# Altium schematic sheet Power.SchDoc: Power Delivery
size A4; Engineer: Jouveer Naidoo; DocumentNumber: 4; Revision: 1; SheetNumber: 4; SheetTotal: 4; SPICEModelCacheIVYGDNUI: <root> / <DocumentId>IVYGDNUI</DocumentId> / <CacheFrame Number="0"> / <Model Name="cap" Kind="MDL"> / <Text>*Default semiconductor capacitor / .MODEL CAP C()</Text> / </Model> / </CacheFrame> / </root>; ProjectIdentifier: Spin Up
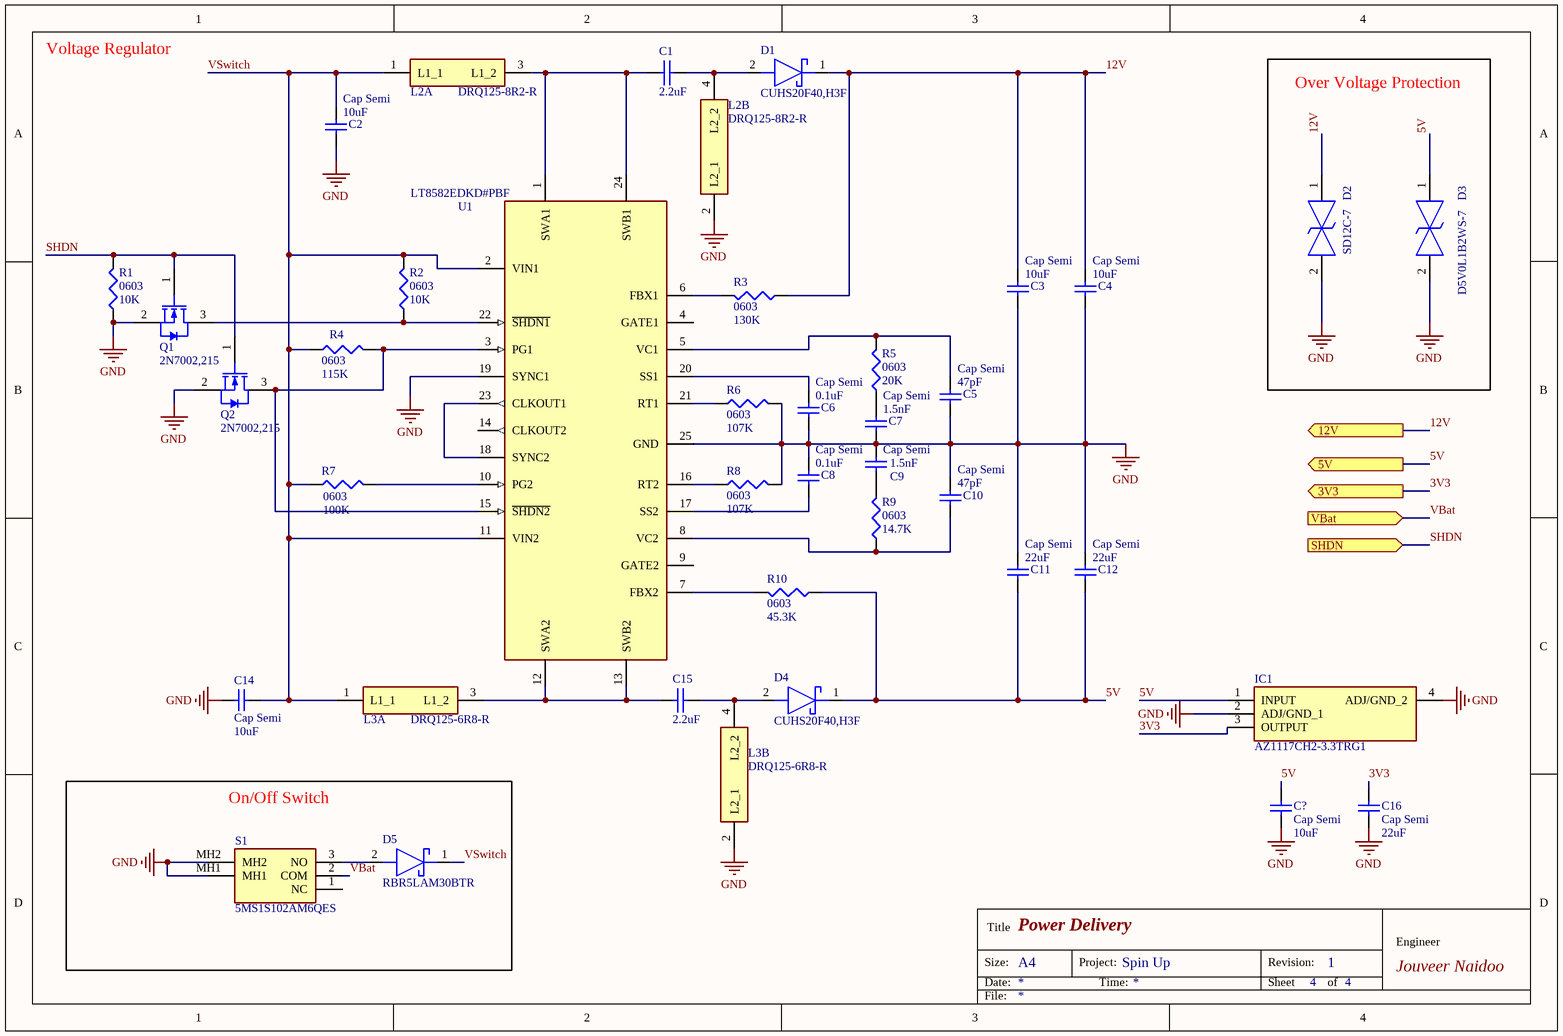
[diagram p0: Power.SchDoc]

## Parts
C1  value 2.2uF  [0805 CAP]  (hidden comment: CerCap_SMT_0805)
C2  Cap Semi  value 10uF  [C1210]
C3  Cap Semi  value 10uF  [C1210]
C4  Cap Semi  value 10uF  [C1210]
C5  Cap Semi  value 47pF  [1608[0603]]
C6  Cap Semi  value 0.1uF  [1608[0603]]
C7  Cap Semi  value 1.5nF  [1608[0603]]
C8  Cap Semi  value 0.1uF  [1608[0603]]
C9  Cap Semi  value 1.5nF  [1608[0603]]
C10  Cap Semi  value 47pF  [1608[0603]]
C11  Cap Semi  value 22uF  [C1210]
C12  Cap Semi  value 22uF  [C1210]
C14  Cap Semi  value 10uF  [C1210]
C15  value 2.2uF  [0805 CAP]  (hidden comment: CerCap_SMT_0805)
C16  Cap Semi  value 22uF  [C1210]
C?  Cap Semi  value 10uF  [C1210]
D1  CUHS20F40,H3F  [CUHS20F40H3F]
D2  SD12C-7  [SD12C7]
D3  D5V0L1B2WS-7  [D5V0L1B2WS7]
D4  CUHS20F40,H3F  [CUHS20F40H3F]
D5  RBR5LAM30BTR  [SODFL4725X105N]
IC1  AZ1117CH2-3.3TRG1  [SOT230P700X180-4N]
L2  DRQ125-8R2-R  [DRQ125-8R2-R-Footprint-1]  (parts A,B of 2)
L3  DRQ125-6R8-R  [DRQ125-6R8-R-Footprint-1]  (parts A,B of 2)
Q1  2N7002,215  [NXP-SOT23-3_V]
Q2  2N7002,215  [NXP-SOT23-3_V]
R1  0603  value 10K  [J1-0603]
R2  0603  value 10K  [J1-0603]
R3  0603  value 130K  [J1-0603]
R4  0603  value 115K  [J1-0603]
R5  0603  value 20K  [J1-0603]
R6  0603  value 107K  [J1-0603]
R7  0603  value 100K  [J1-0603]
R8  0603  value 107K  [J1-0603]
R9  0603  value 14.7K  [J1-0603]
R10  0603  value 45.3K  [J1-0603]
S1  5MS1S102AM6QES  [5MS1S102AM6QES]
U1  LT8582EDKD#PBF  [FP-DKD-24-05-08-1864-MFG]

## Blocks framed on the sheet
Over Voltage Protection: D2 D3
On/Off Switch: D5 S1

## Ports
3V3 (out), 5V (out), 12V (out), SHDN (in), VBat (in)

## Nets
GND: C2.1 C3.1 C4.1 C5.1 C6.1 C7.1 C8.2 C9.2 C10.2 C11.2 C12.2 C14.1 C16.2 C?.1 D2.2 D3.2 IC1.2(ADJ/GND_1) IC1.4(ADJ/GND_2) L2.2(L2_1) L3.2(L2_1) Q1.2(S) Q2.2(S) R1.1 R6.2 R8.2 S1.MH1 S1.MH2 U1.19(SYNC1) U1.25(GND)
3V3: C16.1 IC1.3(OUTPUT) ; port 3V3
5V: C11.1 C12.1 C?.2 D3.1 D4.1(K) IC1.1(INPUT) R10.1 ; port 5V
12V: C3.2 C4.2 D1.1(K) D2.1 R3.1 ; port 12V
SHDN: Q1.1(G) Q2.1(G) R1.2 ; port SHDN
VBat: S1.2(COM) ; port VBat
VSwitch: C2.2 C14.2 D5.1(K) L2.1(L1_1) L3.1(L1_1) R2.2 R4.1 R7.1 U1.2(VIN1) U1.11(VIN2)
NetC1_1: C1.1 L2.3(L1_2) U1.1(SWA1) U1.24(SWB1)
NetC1_2: C1.2 D1.2(A) L2.4(L2_2)
NetC5_2: C5.2 R5.2 U1.5(VC1)
NetC6_2: C6.2 U1.20(SS1)
NetC7_2: C7.2 R5.1
NetC8_1: C8.1 U1.17(SS2)
NetC9_1: C9.1 R9.2
NetC10_1: C10.1 R9.1 U1.8(VC2)
NetC15_1: C15.1 L3.3(L1_2) U1.12(SWA2) U1.13(SWB2)
NetC15_2: C15.2 D4.2(A) L3.4(L2_2)
NetD5_2: D5.2(A) S1.3(NO)
NetQ1_3: Q1.3(D) R2.1 U1.22(~{SHDN1})
NetQ2_3: Q2.3(D) R4.2 U1.3(PG1) U1.15(~{SHDN2})
NetR3_2: R3.2 U1.6(FBX1)
NetR6_1: R6.1 U1.21(RT1)
NetR7_2: R7.2 U1.10(PG2)
NetR8_1: R8.1 U1.16(RT2)
NetR10_2: R10.2 U1.7(FBX2)
NetU1_18: U1.18(SYNC2) U1.23(CLKOUT1)

Not connected (* = marked no-connect by the designer): S1 1(NC); U1 4(GATE1) 9(GATE2) 14(CLKOUT2)

## Notes on the sheet
- Voltage Regulator
- Size:
- Date:
- Title
- A4
- Project:
- Time:
- Revision:
- Sheet
- of
- Engineer
- File:

## Library data of the parts
C1 C15 = CMP-003-000000-1: SMT ceramic capacitor 0805 size; Pin Count: 2; Design Item ID: CerCap_SMT_0805; Component Type: Standard; Source: EE209_SchLib.SchLib
C2-C12 C14 C16 C? = Cap Semi: Capacitor (Semiconductor SIM Model); Published: 8-Jun-2000; LatestRevisionDate: 29-May-2009; LatestRevisionNote: IPC-7351 Footprint Added.; PackageReference: C1206; Publisher: Altium Limited; PackageDescription: Chip Capacitor
D1 D4 = CUHS20F40,H3F: Schottky Diode; Manufacturer_Name: Toshiba; Datasheet Link: https://componentsearchengine.com/Datasheets/1/CUHS20F40,H3F.pdf; Manufacturer_Part_Number: CUHS20F40,H3F; Mouser Part Number: 757-CUHS20F40H3F; Mouser Price/Stock: https://www.mouser.co.uk/ProductDetail/Toshiba/CUHS20F40H3F?qs=PqoDHHvF64%252B%2F27NPskrW9Q%3D%3D
D2 = SD12C-7: TVS Diode (Bi-directional); Manufacturer_Name: Diodes Inc.; Datasheet Link: https://www.diodes.com/assets/Datasheets/SD12C.pdf; Height: 1.2mm; Manufacturer_Part_Number: SD12C-7; Mouser Part Number: 621-SD12C-7; Mouser Price/Stock: https://www.mouser.co.uk/ProductDetail/Diodes-Incorporated/SD12C-7?qs=EBDBlbfErPxugjAb5VaoMA%3D%3D; Arrow Part Number: SD12C-7; Arrow Price/Stock: https://www.arrow.com/en/products/sd12c-7/diodes-incorporated?region=nac
D3 = D5V0L1B2WS-7: TVS Diode (Bi-directional); Manufacturer_Name: Diodes Inc.; Datasheet Link: https://www.diodes.com/assets/Datasheets/D5V0L1B2WS.pdf; Height: 1.2mm; Manufacturer_Part_Number: D5V0L1B2WS-7; Mouser Part Number: 621-D5V0L1B2WS-7; Mouser Price/Stock: https://www.mouser.co.uk/ProductDetail/Diodes-Incorporated/D5V0L1B2WS-7?qs=gfe7vQ8txpVauHZXjiZDzg%3D%3D; Arrow Part Number: D5V0L1B2WS-7; Arrow Price/Stock: https://www.arrow.com/en/products/d5v0l1b2ws-7/diodes-incorporated?region=nac
D5 = RBR5LAM30BTR: Schottky Diode; Manufacturer_Name: ROHM Semiconductor; Datasheet Link: https://fscdn.rohm.com/en/products/databook/datasheet/discrete/diode/schottky_barrier/rbr5lam30btr-e.pdf; Height: 1.05mm; Manufacturer_Part_Number: RBR5LAM30BTR; Mouser Part Number: 755-RBR5LAM30BTR; Mouser Price/Stock: https://www.mouser.co.uk/ProductDetail/ROHM-Semiconductor/RBR5LAM30BTR?qs=4v%252BiZTmLVHGtLozrhLHugw%3D%3D
IC1 = AZ1117CH2-3.3TRG1: Integrated Circuit; Manufacturer_Name: Diodes Inc.; Datasheet Link: https://www.arrow.com/en/products/az1117ch2-3.3trg1/diodes-incorporated; Height: 1.8mm; Manufacturer_Part_Number: AZ1117CH2-3.3TRG1; Mouser Part Number: 621-AZ1117CH2-33TRG1; Mouser Price/Stock: https://www.mouser.co.uk/ProductDetail/Diodes-Incorporated/AZ1117CH2-3.3TRG1?qs=lQAVKuKFhkLc7jCxso2G3w%3D%3D; Arrow Part Number: AZ1117CH2-3.3TRG1; Arrow Price/Stock: https://www.arrow.com/en/products/az1117ch2-3.3trg1/diodes-incorporated?region=nac
L2 = CMP-006-00021-2: Ind Power Shielded Wirewound 8.048uH/32.19uH 20% 100KHz Ferrite 5.54A/2.77A T/R
L3 = CMP-006-00023-1: Ind Power Shielded Wirewound 6.588uH/26.35uH 20% 100KHz Ferrite 6.64A/3.32A T/R
Q1 Q2 = CMP-013-00011-4: N-channel Trench MOSFET, 60 V, 300 mA, -65 to 150 degC, 3-Pin SOT-23 (TO-236AB), RoHS, Tape and Reel; Manufacturer: NXP Semiconductors; Elements: 1; Power: 830mW; Max Dual Supply Voltage: 60V; Rds On Max: 5Ohm; Package Version: Feb-16; Nominal Vgs: 2V; Input Capacitance: 50pF; RoHS Compliant: True; Datasheet URL: http://www.nxp.com/documents/data_sheet/2N7002.pdf; Packaging: TapeandReel; Case/Package: TO-236-3; Package Reference: SOT23-3; Max Operating Temperature: 150°C; Pins: 8; Mounting Technology: SM; Package Quantity: 1; Datasheet Version: Rev. 7, 09/2011; Nominal Dual Supply Voltage: 60V; Min Operating Temperature: -65°C; Package Description: 3-Pin Small Outline Transistor, Body 1.3 x 2.9 mm, Pitch 0.95 mm; Vds Max: 60V
R1-R10 = Res3: Resistor; Published: 8-Jun-2000; LatestRevisionDate: 29-May-2009; LatestRevisionNote: IPC-7351 Footprint Added.; PackageReference: J1-0603; Publisher: Altium Limited; PackageDescription: Chip Resistor
S1 = 5MS1S102AM6QES: Switch; Manufacturer_Name: Dailywell; Datasheet Link: https://cz.mouser.com/datasheet/2/979/Dailywell_01132020_5M_Series-1708766.pdf; Height: 6.6mm; Manufacturer_Part_Number: 5MS1S102AM6QES; Mouser Part Number: 118-5MS1S102AM6QES; Mouser Price/Stock: https://www.mouser.co.uk/ProductDetail/Dailywell/5MS1S102AM6QES?qs=B6kkDfuK7%2FBHVJoQEkyphg%3D%3D
U1 = CMP-019-00050-5: IC REG MULT CONFIG INV ADJ 24DFN